# EasyEDA schematic basketball main board_2020-10-02_16-44-30.json
TITLE: Sheet_1; REV: 1.0; Date: 2020-10-01; Sheet: 1/1; Drawn By: david rizhinashvili; Company: Your Company
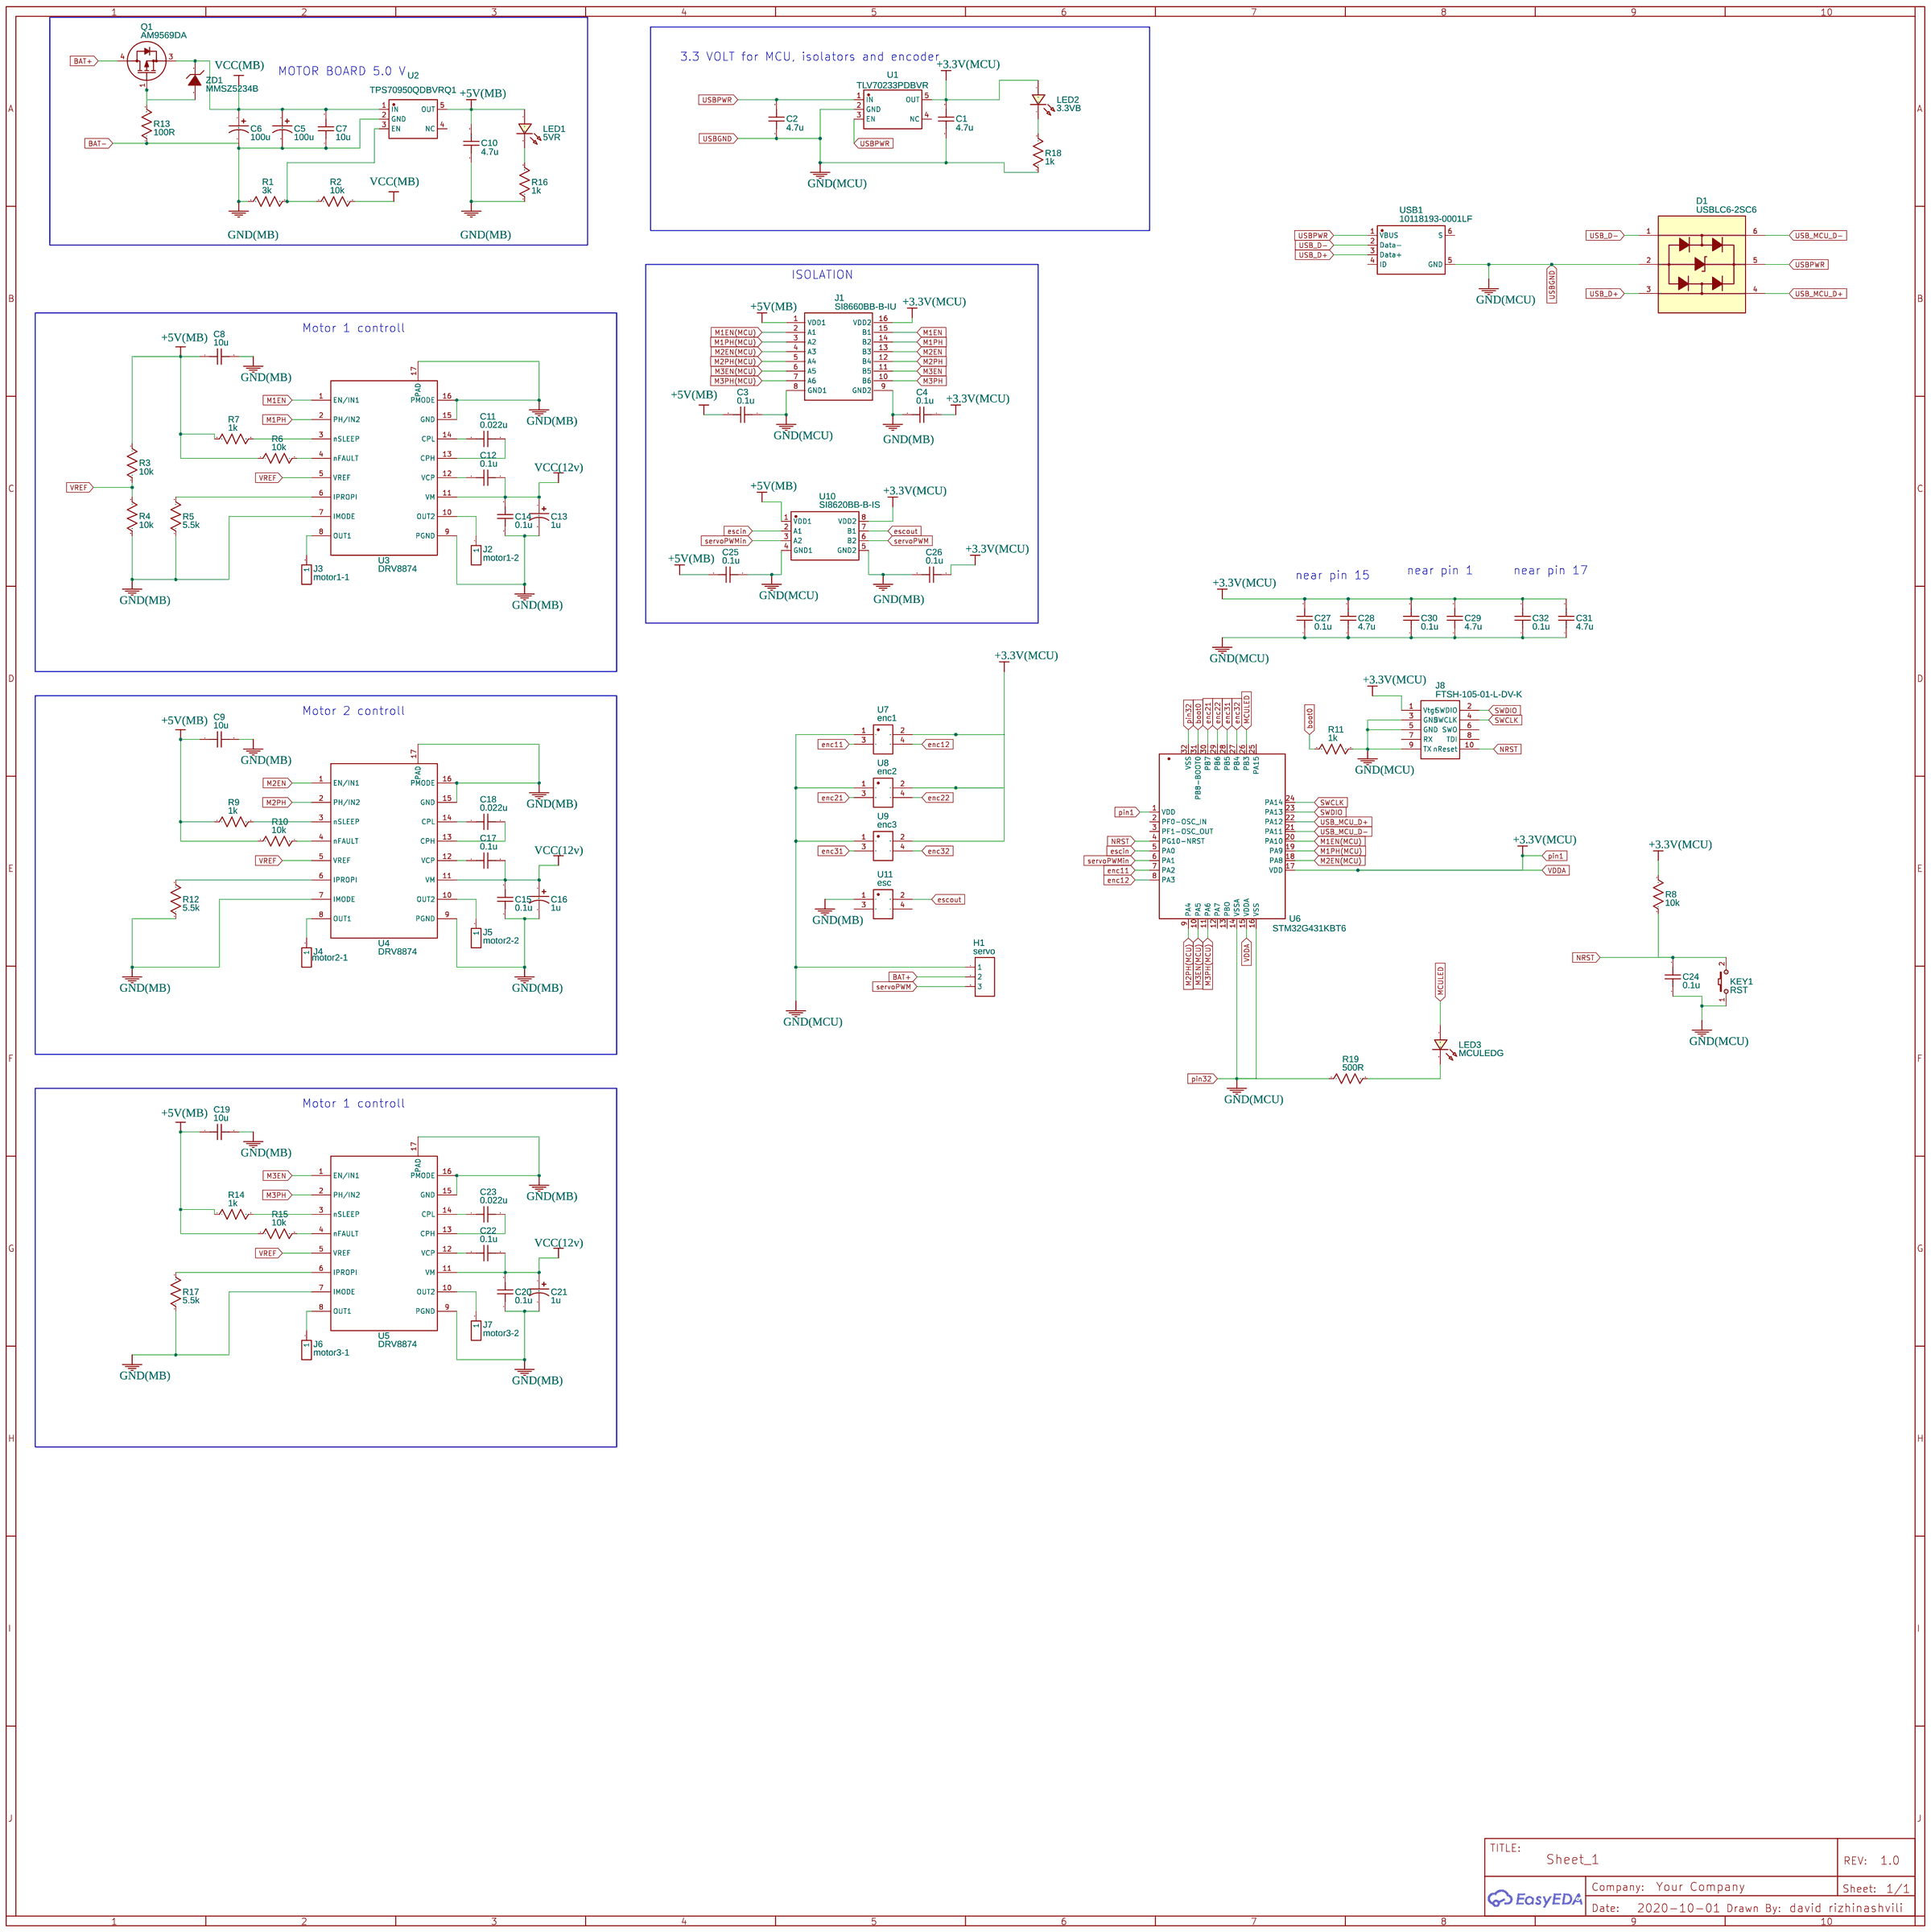
[diagram p0: schematic sheet]

## Parts
C1  4.7u  [C1206]
C2  4.7u  [C1206]
C3  0.1u  [C1206]
C4  0.1u  [C1206]
C5  100u  [CAP-D6.3×F2.5]
C6  100u  [CAP-D6.3×F2.5]
C7  10u  [C1206]
C8  10u  [C1206]
C9  10u  [C1206]
C10  4.7u  [C1206]
C11  0.022u  [C1206]
C12  0.1u  [C1206]
C13  1u  [CAP-D6.3×F2.5]
C14  0.1u  [C1206]
C15  0.1u  [C1206]
C16  1u  [CAP-D6.3×F2.5]
C17  0.1u  [C1206]
C18  0.022u  [C1206]
C19  10u  [C1206]
C20  0.1u  [C1206]
C21  1u  [CAP-D6.3×F2.5]
C22  0.1u  [C1206]
C23  0.022u  [C1206]
C24  0.1u  [C1206]
C25  0.1u  [C1206]
C26  0.1u  [C1206]
C27  0.1u  [C1206]
C28  4.7u  [C1206]
C29  4.7u  [C1206]
C30  0.1u  [C1206]
C31  4.7u  [C1206]
C32  0.1u  [C1206]
D1  USBLC6-2SC6  [SOT-23-6_L2.9-W1.6-P0.95-LS2.8-BR]
H1  servo  [HDR-F-2.54_1X3]
J1  SI8660BB-B-IU  [SOP64P600X175-16N]
J2  motor1-2  [HDR-M-2.54_1X1]
J3  motor1-1  [HDR-M-2.54_1X1]
J4  motor2-1  [HDR-M-2.54_1X1]
J5  motor2-2  [HDR-M-2.54_1X1]
J6  motor3-1  [HDR-M-2.54_1X1]
J7  motor3-2  [HDR-M-2.54_1X1]
J8  FTSH-105-01-L-DV-K  [FTSH-105-01-L-DV-K]
KEY1  RST  [KEY-SMD_2P-L6.2-W3.6-LS8.0]
LED1  5VR  [LED0603_RED]
LED2  3.3VB  [LED0603_RED]
LED3  MCULEDG  [LED0603_RED]
Q1  AM9569DA  [TO-252-2_L6.5-W6.1-P4.58-LS10.0-TL]
R1  3k  [R1206]
R2  10k  [R1206]
R3  10k  [R0603]
R4  10k  [R0603]
R5  5.5k  [R0603]
R6  10k  [R0603]
R7  1k  [R0603]
R8  10k  [R1206]
R9  1k  [R0603]
R10  10k  [R0603]
R11  1k  [R1206]
R12  5.5k  [R0603]
R13  100R  [R1206]
R14  1k  [R0603]
R15  10k  [R0603]
R16  1k  [R1206]
R17  5.5k  [R0603]
R18  1k  [R1206]
R19  500R  [R1206]
U1  TLV70233PDBVR  [SOT-23-5_L3.0-W1.7-P0.95-LS2.8-BL]
U2  TPS70950QDBVRQ1  [SOT-23-5_L3.0-W1.7-P0.95-LS2.8-BR]
U3  DRV8874  [DRV8874 FOOTPRINT]
U4  DRV8874  [DRV8874 FOOTPRINT]
U5  DRV8874  [DRV8874 FOOTPRINT]
U6  STM32G431KBT6  [LQFP-32_L7.0-W7.0-P0.80-LS9.0-BL]
U7  enc1  [CONN-TH_4P-P2.54-S2.54_L5.2-W7.1]
U8  enc2  [CONN-TH_4P-P2.54-S2.54_L5.2-W7.1]
U9  enc3  [CONN-TH_4P-P2.54-S2.54_L5.2-W7.1]
U10  SI8620BB-B-IS  [SOIC-8_L4.9-W3.9-P1.27-LS6.0-BL]
U11  esc  [CONN-TH_4P-P2.54-S2.54_L5.2-W7.1]
USB1  10118193-0001LF  [MICRO-USB-SMD_10118193-0001LF]
ZD1  MMSZ5234B  [SOD-123_L2.8-W1.8-LS3.7-RD]

## Library data of the parts
C1-C4 C7-C12 C14 C15 C17-C20 C22-C32 = C_1206_US: Contributor: LCEDA_Lib
C5 C6 C13 C16 C21 = CE_TH_D6.3×F2.5_US: Contributor: LCEDA_Lib
D1 = USBLC6-2SC6: Supplier: LCSC; Manufacturer: STMicroelectronics; image: //image.lceda.cn/szlcsc/C7519.jpg; Supplier Part: C7519; LCSC Assembly: Yes; SMT Type: Extend
H1 = HDR-F-2.54_1x3: Supplier Part: C146690; Supplier: LCSC; Contributor: LCEDA_Lib
J1 = SI8660BB-B-IU: Contributor: david rizhinashvili
J2-J7 = HDR-M-2.54_1x1: Supplier Part: C81276; Supplier: LCSC; Contributor: LCEDA_Lib
J8 = FTSH-105-01-L-DV-K: Supplier Part: SAM8799-ND; Supplier: Mouser; link: http://www.digikey.com/product-detail/en/samtec-inc/FTSH-105-01-L-DV-K/SAM8799-ND/1875039; Contributor: OBC Gang
KEY1 = K2-3.6×6.1_SMD: Supplier Part: C118141; Supplier: LCSC; Manufacturer Part: K2-1107ST-A4SW-06; Contributor: LCEDA_Lib; 制造商: 韩国韩荣
LED1-LED3 = LED-0603_R: Manufacturer: EVERLIGHT(台湾亿光); Manufacturer Part: 19-217/R6C-AL1M2VY/3T; Supplier Part: C72044; Supplier: LCSC; Contributor: LCEDA_01
Q1 = AM9569DA: Supplier: LCSC; Supplier Part: C224223; Manufacturer: Axelite Tech; Contributor: LCSC; LCSC Assembly: Yes; SMT Type: Extend
R1 R2 R8 R11 R13 R16 R18 R19 = R_1206_US: Contributor: LCEDA_Lib
R3-R7 R9 R10 R12 R14 R15 R17 = R_0603_US: Contributor: LCEDA_Lib
U1 = TLV70233PDBVR: Supplier: LCSC; Manufacturer: TI; Contributor: LCSC; Supplier Part: C123134; LCSC Assembly: Yes; SMT Type: Extend
U2 = TPS70950QDBVRQ1: Supplier: LCSC; Supplier Part: C485909; Manufacturer: Texas Instruments; Contributor: LCSC
U3-U5 = DRV8874: Manufacturer: Texas Instruments; Supplier: TI; link: https://www.ti.com/product/DRV8874; Contributor: Plexus
U6 = STM32G431KBT6: Supplier: LCSC; Supplier Part: C529357; Manufacturer: STMicroelectronics; Contributor: LCSC
U7-U9 U11 = 215079-4: Supplier: LCSC; Supplier Part: C306232; Manufacturer: TE Connectivity; Contributor: LCSC
U10 = SI8620BB-B-IS: Supplier: LCSC; Supplier Part: C430264; Manufacturer: SILICON LABS; Contributor: LCSC
USB1 = 10118193-0001LF: Supplier: LCSC; Supplier Part: C132562; Manufacturer: Amphenol ICC; Contributor: LCSC
ZD1 = MMSZ5234B: Supplier: LCSC; Manufacturer: CJ; image: //image.lceda.cn/szlcsc/C21556.jpg; Supplier Part: C21556; LCSC Assembly: Yes; SMT Type: Extend

## Nets
+3.3V(MCU): C1.2 C4.1 C26.1 C27.2 C28.2 C29.2 C30.2 C31.2 C32.2 J1.16(VDD2) J8.1(Vtgt) LED2.1 R8.2 U1.5(OUT) U6.1(VDD) U6.15(VDDA) U6.17(VDD) U7.2 U8.2 U9.2 U10.8(VDD2)
+5V(MB): C3.2 C8.1 C9.1 C10.2 C19.1 C25.2 J1.1(VDD1) LED1.1 R3.1 R6.1 R7.1 R9.1 R10.1 R14.1 R15.1 U2.5(OUT) U10.1(VDD1)
GND(MCU): C1.1 C2.1 C3.1 C24.1 C25.1 C27.1 C28.1 C29.1 C30.1 C31.1 C32.1 D1.2 H1.1 J1.8(GND1) J8.3(GND) J8.5(GND) J8.9(TX) KEY1.1 R11.2 R18.1 R19.1 U1.2(GND) U6.14(VSSA) U6.16(VSS) U6.32(VSS) U7.1 U8.1 U9.1 U10.4(GND1) USB1.5(GND)
VCC(12v): C12.2 C13.1 C14.2 C15.2 C16.1 C17.2 C20.2 C21.1 C22.2 U3.11(VM) U4.11(VM) U5.11(VM)
VCC(MB): C5.1 C6.1 C7.2 Q1.3(S) R2.2 U2.1(IN) ZD1.1(K)
BAT+: H1.2 Q1.4(D)
BAT-: C4.2 C5.2 C6.2 C7.1 C8.2 C9.2 C10.1 C13.2 C14.1 C15.1 C16.2 C19.2 C20.1 C21.2 C26.2 J1.9(GND2) R1.1 R4.2 R5.1 R12.1 R13.1 R16.1 R17.1 U2.2(GND) U3.7(IMODE) U3.9(PGND) U3.15(GND) U3.16(PMODE) U3.17(PAD) U4.7(IMODE) U4.9(PGND) U4.15(GND) U4.16(PMODE) U4.17(PAD) U5.7(IMODE) U5.9(PGND) U5.15(GND) U5.16(PMODE) U5.17(PAD) U10.5(GND2) U11.1
boot0: R11.1 U6.31(PB8-BOOT0)
enc11: U6.7(PA2) U7.3
enc12: U6.8(PA3) U7.4
enc21: U6.30(PB7) U8.3
enc22: U6.29(PB6) U8.4
enc31: U6.28(PB5) U9.3
enc32: U6.27(PB4) U9.4
escin: U6.5(PA0) U10.2(A1)
escout: U10.7(B1) U11.2
M1EN: J1.15(B1) U3.1(EN/IN1)
M1EN(MCU): J1.2(A1) U6.20(PA10)
M1PH: J1.14(B2) U3.2(PH/IN2)
M1PH(MCU): J1.3(A2) U6.19(PA9)
M2EN: J1.13(B3) U4.1(EN/IN1)
M2EN(MCU): J1.4(A3) U6.18(PA8)
M2PH: J1.12(B4) U4.2(PH/IN2)
M2PH(MCU): J1.5(A4) U6.9(PA4)
M3EN: J1.11(B5) U5.1(EN/IN1)
M3EN(MCU): J1.6(A5) U6.10(PA5)
M3PH: J1.10(B6) U5.2(PH/IN2)
M3PH(MCU): J1.7(A6) U6.11(PA6)
MCULED: LED3.1 U6.26(PB3)
NRST: C24.2 J8.10(nReset) KEY1.2 R8.1 U6.4(PG10-NRST)
servoPWM: H1.3 U10.6(B2)
servoPWMin: U6.6(PA1) U10.3(A2)
SWCLK: J8.4(SWCLK) U6.24(PA14)
SWDIO: J8.2(SWDIO) U6.23(PA13)
USB_D+: D1.3 USB1.3(Data+)
USB_D-: D1.1 USB1.2(Data-)
USB_MCU_D+: D1.4 U6.22(PA12)
USB_MCU_D-: D1.6 U6.21(PA11)
USBPWR: C2.2 D1.5 U1.1(IN) U1.3(EN) USB1.1(VBUS)
VREF: R3.2 R4.1 U3.5(VREF) U4.5(VREF) U5.5(VREF)
Net-(C11-1): C11.1 U3.14(CPL)
Net-(C11-2): C11.2 U3.13(CPH)
Net-(C12-1): C12.1 U3.12(VCP)
Net-(C17-1): C17.1 U4.12(VCP)
Net-(C18-1): C18.1 U4.14(CPL)
Net-(C18-2): C18.2 U4.13(CPH)
Net-(C22-1): C22.1 U5.12(VCP)
Net-(C23-1): C23.1 U5.14(CPL)
Net-(C23-2): C23.2 U5.13(CPH)
Net-(J2-1): J2.1 U3.10(OUT2)
Net-(J3-1): J3.1 U3.8(OUT1)
Net-(J4-1): J4.1 U4.8(OUT1)
Net-(J5-1): J5.1 U4.10(OUT2)
Net-(J6-1): J6.1 U5.8(OUT1)
Net-(J7-1): J7.1 U5.10(OUT2)
Net-(LED1-2): LED1.2 R16.2
Net-(LED2-2): LED2.2 R18.2
Net-(LED3-2): LED3.2 R19.2
Net-(Q1-1): Q1.1(G) R13.2 ZD1.2(A)
Net-(R1-2): R1.2 R2.1 U2.3(EN)
Net-(R5-2): R5.2 U3.6(IPROPI)
Net-(R6-2): R6.2 U3.4(nFAULT)
Net-(R7-2): R7.2 U3.3(nSLEEP)
Net-(R9-2): R9.2 U4.3(nSLEEP)
Net-(R10-2): R10.2 U4.4(nFAULT)
Net-(R12-2): R12.2 U4.6(IPROPI)
Net-(R14-2): R14.2 U5.3(nSLEEP)
Net-(R15-2): R15.2 U5.4(nFAULT)
Net-(R17-2): R17.2 U5.6(IPROPI)

Not connected (* = marked no-connect by the designer): J8 6(SWO) 7(RX) 8(TDI); U1 4(NC); U2 4(NC); U6 2(PF0-OSC_IN) 3(PF1-OSC_OUT) 12(PA7) 13(PBO) 25(PA15); U11 3 4; USB1 4(ID) 6(S)

## Notes on the sheet
- 3.3 VOLT for MCU, isolators and encoder
- MOTOR BOARD 5.0 V
- ISOLATION
- Motor 1 controll
- near pin 15
- near pin 1
- near pin 17
- Motor 2 controll
- Motor 1 controll
